# EAGLE schematic Cell stretcher (EAGLE 9.6.2)
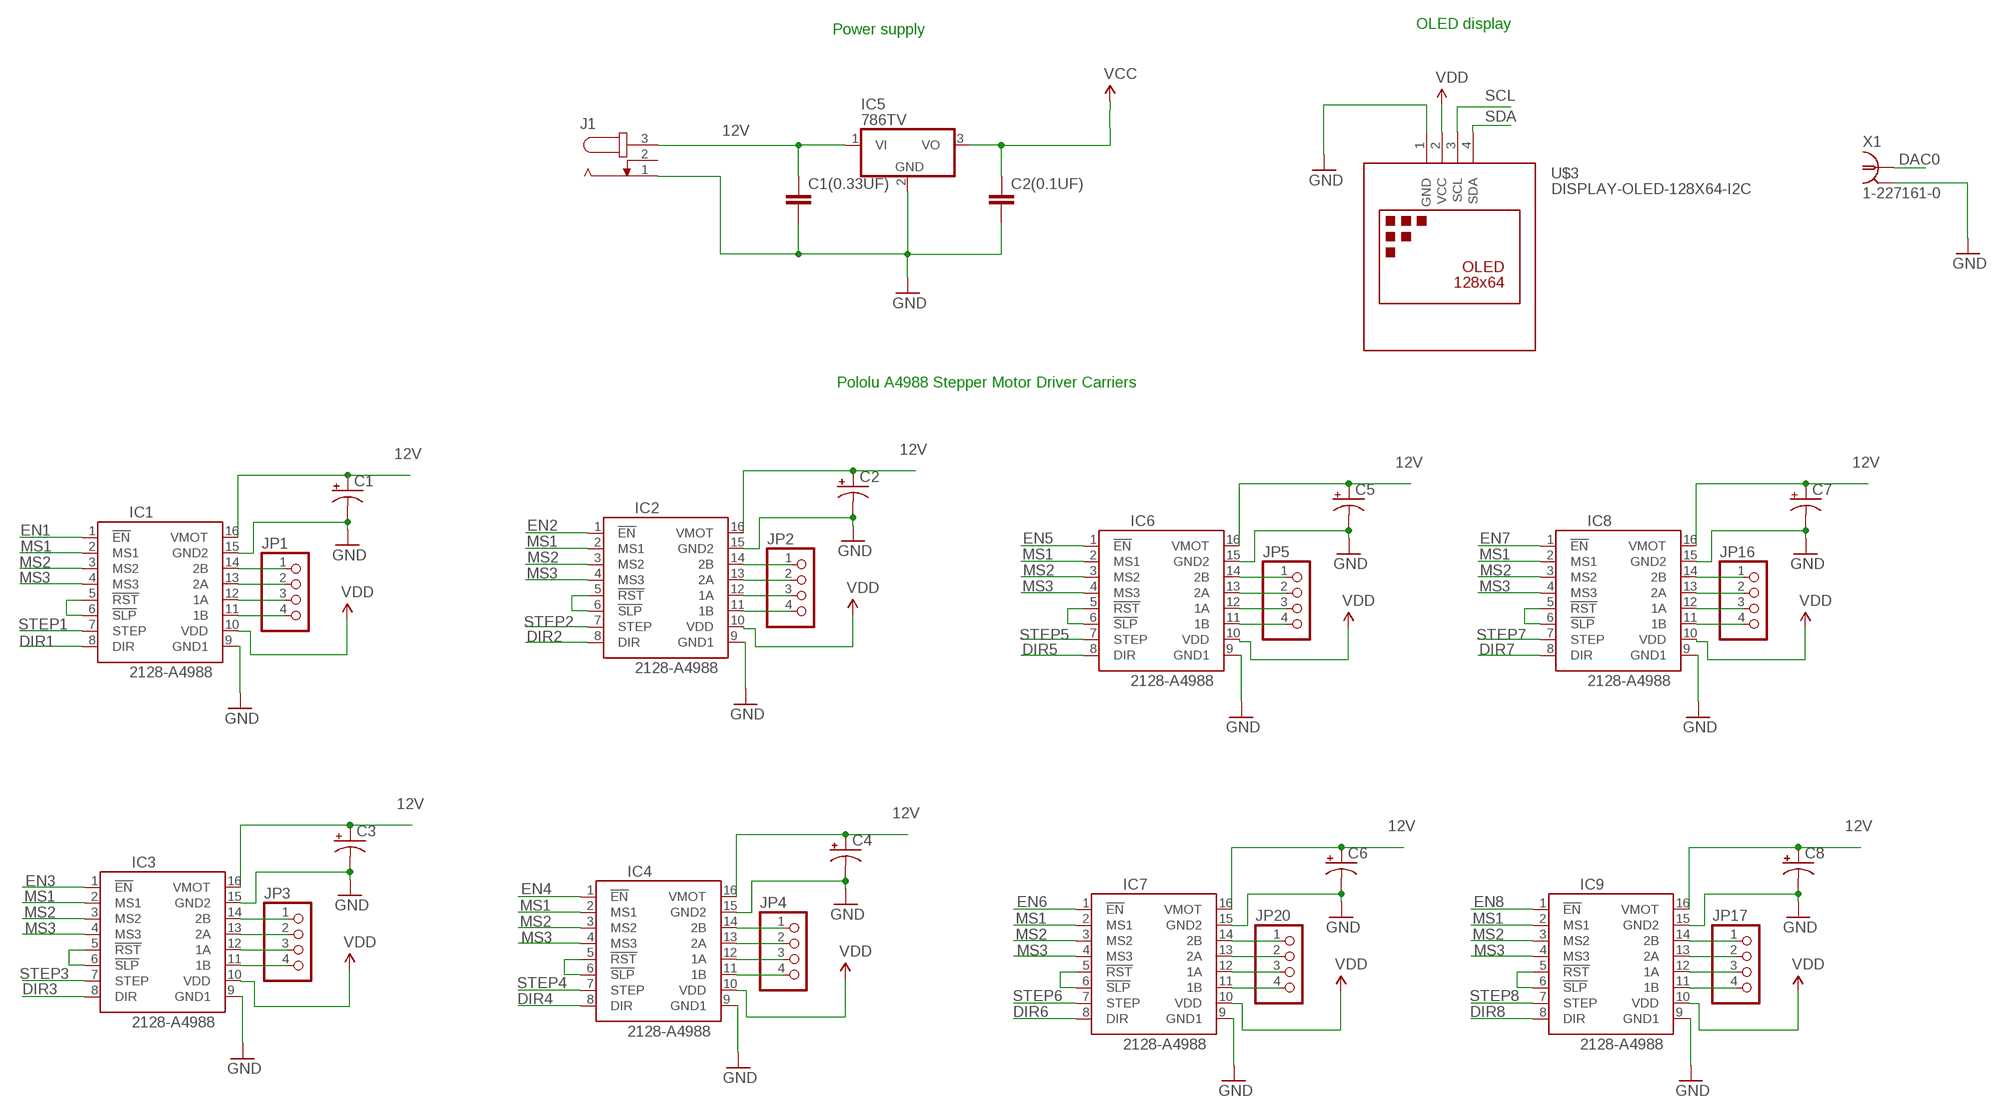
[diagram p0: schematic, sheet 1, part 1 of 2]
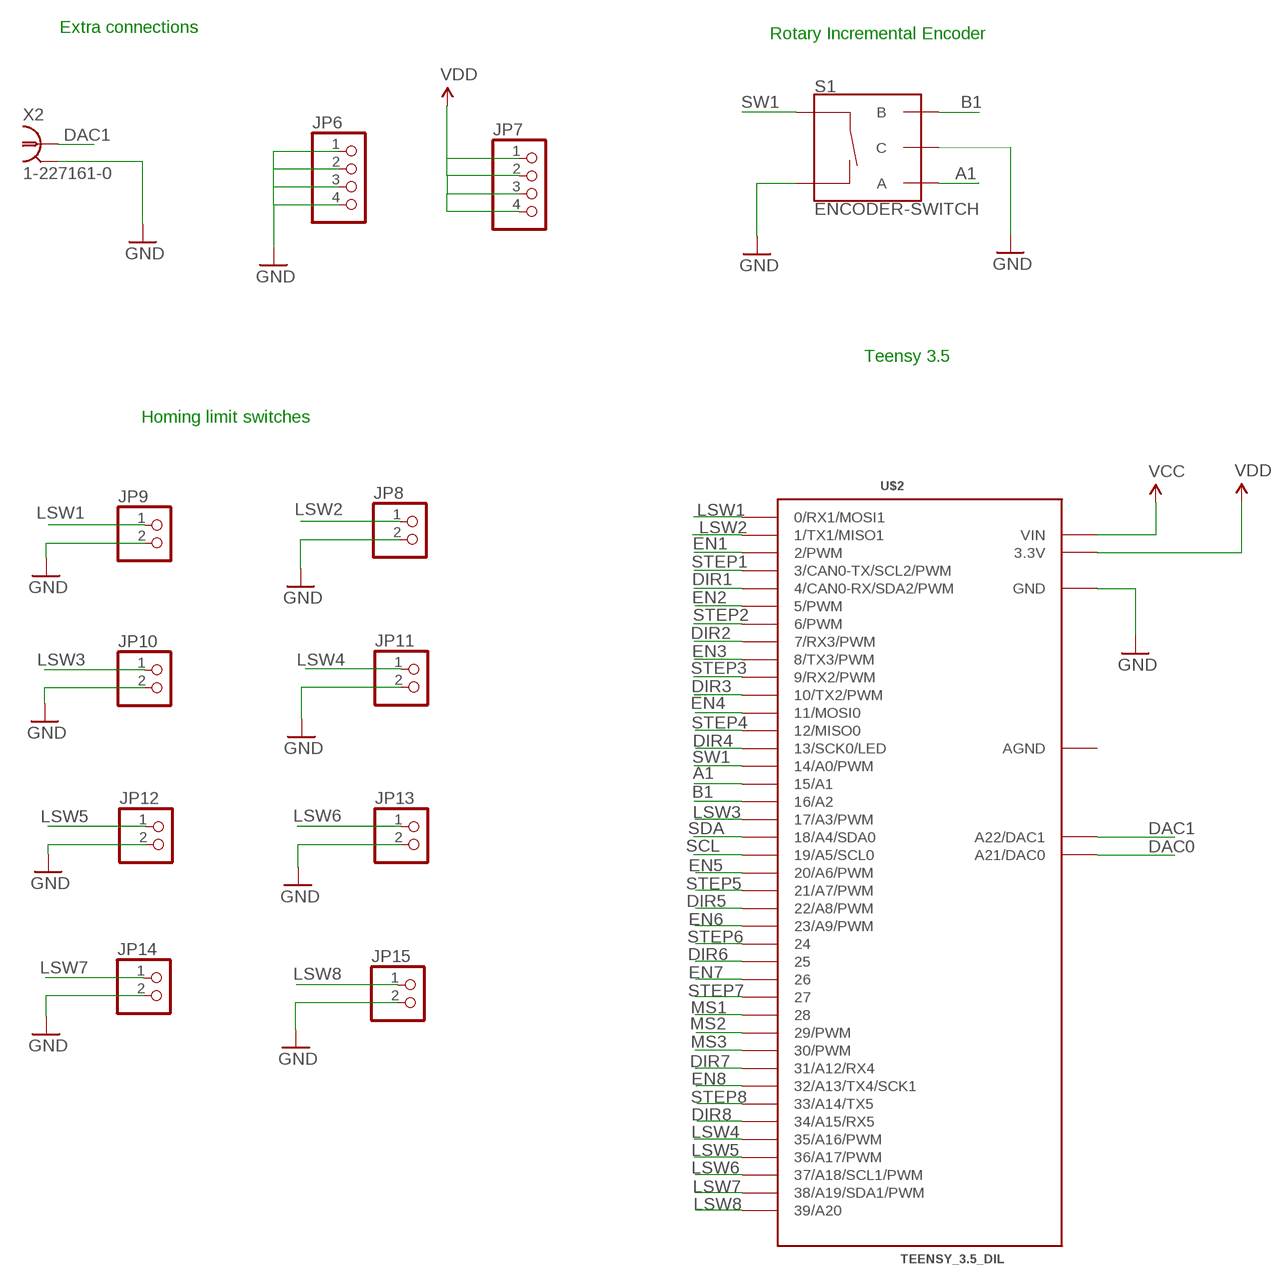
[diagram p1: schematic, sheet 1, part 2 of 2]

## Parts
C1  CPOL-USE5-5  [E5-5]
C1(0.33UF)  C2.5/4  [C2.5-4]
C2  CPOL-USE5-5  [E5-5]
C2(0.1UF)  C2.5/2  [C2.5-2]
C3  CPOL-USE5-5  [E5-5]
C4  CPOL-USE5-5  [E5-5]
C5  CPOL-USE5-5  [E5-5]
C6  CPOL-USE5-5  [E5-5]
C7  CPOL-USE5-5  [E5-5]
C8  CPOL-USE5-5  [E5-5]
IC1  2128-A4988  [A4988]
IC2  2128-A4988  [A4988]
IC3  2128-A4988  [A4988]
IC4  2128-A4988  [A4988]
IC5  786TV  [TO220V]
IC6  2128-A4988  [A4988]
IC7  2128-A4988  [A4988]
IC8  2128-A4988  [A4988]
IC9  2128-A4988  [A4988]
J1  JACK-PLUG0  [SPC4077]
JP1  PINHD-1X4  [1X04]
JP2  PINHD-1X4  [1X04]
JP3  PINHD-1X4  [1X04]
JP4  PINHD-1X4  [1X04]
JP5  PINHD-1X4  [1X04]
JP6  PINHD-1X4  [1X04]
JP7  PINHD-1X4  [1X04]
JP8  PINHD-1X2  [1X02]
JP9  PINHD-1X2  [1X02]
JP10  PINHD-1X2  [1X02]
JP11  PINHD-1X2  [1X02]
JP12  PINHD-1X2  [1X02]
JP13  PINHD-1X2  [1X02]
JP14  PINHD-1X2  [1X02]
JP15  PINHD-1X2  [1X02]
JP16  PINHD-1X4  [1X04]
JP17  PINHD-1X4  [1X04]
JP20  PINHD-1X4  [1X04]
S1  ENCODER-SWITCH  [ROTARY_ENC_PLAIN]
U$2  TEENSY_3.5_DIL  [TEENSY_3.5_DIL]
U$3  DISPLAY-OLED-128X64-I2C  [DISPLAY-OLED-128X64-I2C]
X1  1-227161-0  [AMP_227161]
X2  1-227161-0  [AMP_227161]

## Nets
12V: C1(0.33UF).1 C1.+ C2.+ C3.+ C4.+ C5.+ C6.+ C7.+ C8.+ IC1.16(VMOT) IC2.16(VMOT) IC3.16(VMOT) IC4.16(VMOT) IC5.1(VI) IC6.16(VMOT) IC7.16(VMOT) IC8.16(VMOT) IC9.16(VMOT) J1.3
A1: S1.A U$2.15/A1
B1: S1.B U$2.16/A2
DAC0: U$2.A21(A21/DAC0) X1.1
DAC1: U$2.A22(A22/DAC1) X2.1
DIR1: IC1.8(DIR) U$2.4(4/CAN0-RX/SDA2/PWM)
DIR2: IC2.8(DIR) U$2.7(7/RX3/PWM)
DIR3: IC3.8(DIR) U$2.10(10/TX2/PWM)
DIR4: IC4.8(DIR) U$2.13(13/SCK0/LED)
DIR5: IC6.8(DIR) U$2.22/A8(22/A8/PWM)
DIR6: IC7.8(DIR) U$2.25
DIR7: IC8.8(DIR) U$2.31/A12(31/A12/RX4)
DIR8: IC9.8(DIR) U$2.34/A15(34/A15/RX5)
EN1: IC1.1(!EN) U$2.2(2/PWM)
EN2: IC2.1(!EN) U$2.5(5/PWM)
EN3: IC3.1(!EN) U$2.8(8/TX3/PWM)
EN4: IC4.1(!EN) U$2.11(11/MOSI0)
EN5: IC6.1(!EN) U$2.20/A6(20/A6/PWM)
EN6: IC7.1(!EN) U$2.23/A9(23/A9/PWM)
EN7: IC8.1(!EN) U$2.26
EN8: IC9.1(!EN) U$2.32/A13(32/A13/TX4/SCK1)
GND: C1(0.33UF).2 C1.- C2(0.1UF).2 C2.- C3.- C4.- C5.- C6.- C7.- C8.- IC1.9(GND1) IC1.15(GND2) IC2.9(GND1) IC2.15(GND2) IC3.9(GND1) IC3.15(GND2) IC4.9(GND1) IC4.15(GND2) IC5.2(GND) IC6.9(GND1) IC6.15(GND2) IC7.9(GND1) IC7.15(GND2) IC8.9(GND1) IC8.15(GND2) IC9.9(GND1) IC9.15(GND2) J1.1 JP6.1 JP6.2 JP6.3 JP6.4 JP8.2 JP9.2 JP10.2 JP11.2 JP12.2 JP13.2 JP14.2 JP15.2 S1.C S1.SW- U$2.GND U$2.GND1(GND) U$3.1(GND) X1.2 X2.2
LSW1: JP9.1 U$2.0(0/RX1/MOSI1)
LSW2: JP8.1 U$2.1(1/TX1/MISO1)
LSW3: JP10.1 U$2.17/A3(17/A3/PWM)
LSW4: JP11.1 U$2.35/A16(35/A16/PWM)
LSW5: JP12.1 U$2.36/A17(36/A17/PWM)
LSW6: JP13.1 U$2.37/A18(37/A18/SCL1/PWM)
LSW7: JP14.1 U$2.38/A19(38/A19/SDA1/PWM)
LSW8: JP15.1 U$2.39/A20
MS1: IC1.2(MS1) IC2.2(MS1) IC3.2(MS1) IC4.2(MS1) IC6.2(MS1) IC7.2(MS1) IC8.2(MS1) IC9.2(MS1) U$2.28
MS2: IC1.3(MS2) IC2.3(MS2) IC3.3(MS2) IC4.3(MS2) IC6.3(MS2) IC7.3(MS2) IC8.3(MS2) IC9.3(MS2) U$2.29(29/PWM)
MS3: IC1.4(MS3) IC2.4(MS3) IC3.4(MS3) IC4.4(MS3) IC6.4(MS3) IC7.4(MS3) IC8.4(MS3) IC9.4(MS3) U$2.30(30/PWM)
N$1: IC1.14(2B) JP1.1
N$2: IC1.13(2A) JP1.2
N$3: IC1.12(1A) JP1.3
N$4: IC1.11(1B) JP1.4
N$5: IC2.14(2B) JP2.1
N$6: IC2.13(2A) JP2.2
N$7: IC2.12(1A) JP2.3
N$8: IC2.11(1B) JP2.4
N$9: IC6.14(2B) JP5.1
N$10: IC6.13(2A) JP5.2
N$11: IC6.12(1A) JP5.3
N$12: IC6.11(1B) JP5.4
N$13: IC6.5(!RST) IC6.6(!SLP)
N$14: IC7.14(2B) JP20.1
N$15: IC2.5(!RST) IC2.6(!SLP)
N$16: IC7.13(2A) JP20.2
N$17: IC7.12(1A) JP20.3
N$18: IC7.11(1B) JP20.4
N$19: IC7.5(!RST) IC7.6(!SLP)
N$20: IC8.14(2B) JP16.1
N$21: IC8.13(2A) JP16.2
N$22: IC8.12(1A) JP16.3
N$23: IC1.5(!RST) IC1.6(!SLP)
N$24: IC3.14(2B) JP3.1
N$25: IC3.13(2A) JP3.2
N$26: IC3.12(1A) JP3.3
N$27: IC3.11(1B) JP3.4
N$28: IC8.11(1B) JP16.4
N$29: IC8.5(!RST) IC8.6(!SLP)
N$30: IC9.14(2B) JP17.1
N$31: IC9.13(2A) JP17.2
N$32: IC9.12(1A) JP17.3
N$33: IC9.11(1B) JP17.4
N$34: IC9.5(!RST) IC9.6(!SLP)
N$35: IC3.5(!RST) IC3.6(!SLP)
N$37: IC4.14(2B) JP4.1
N$38: IC4.13(2A) JP4.2
N$39: IC4.12(1A) JP4.3
N$40: IC4.11(1B) JP4.4
N$47: IC4.5(!RST) IC4.6(!SLP)
SCL: U$2.19/A5(19/A5/SCL0) U$3.3(SCL)
SDA: U$2.18/A4(18/A4/SDA0) U$3.4(SDA)
STEP1: IC1.7(STEP) U$2.3(3/CAN0-TX/SCL2/PWM)
STEP2: IC2.7(STEP) U$2.6(6/PWM)
STEP3: IC3.7(STEP) U$2.9(9/RX2/PWM)
STEP4: IC4.7(STEP) U$2.12(12/MISO0)
STEP5: IC6.7(STEP) U$2.21/A7(21/A7/PWM)
STEP6: IC7.7(STEP) U$2.24
STEP7: IC8.7(STEP) U$2.27
STEP8: IC9.7(STEP) U$2.33/A14(33/A14/TX5)
SW1: S1.SW+ U$2.14/A0(14/A0/PWM)
VCC: C2(0.1UF).1 IC5.3(VO) U$2.VIN
VDD: IC1.10(VDD) IC2.10(VDD) IC3.10(VDD) IC4.10(VDD) IC6.10(VDD) IC7.10(VDD) IC8.10(VDD) IC9.10(VDD) JP7.1 JP7.2 JP7.3 JP7.4 U$2.3.3V U$2.3.3V3(3.3V) U$3.2(VCC)
Unconnected: J1.2

## Notes on the sheet
- OLED display
- Power supply
- Extra connections
- Rotary Incremental Encoder
- Teensy 3.5
- Pololu A4988 Stepper Motor Driver Carriers
- Homing limit switches

## Power pins joined to a net without a drawn wire
AGND: U$2.AGND

## Library data of the parts
C1-C8 = adafruit:CPOL-US: POLARIZED CAPACITOR, American symbol
C1(0.33UF) C2(0.1UF) = capacitor-wima:C: CAPACITOR naming: grid - package width
IC1-IC4 IC6-IC9 = pololu-stepper-driver:2128-A4988: A4988 Stepper Motor Driver Carrier; Black Edition #2128 A4988 Stepper Motor Driver Carrier; Black Edition <https://www.pololu.com/product/2128> in Japan, Suzaku Lab. Ltd. <https://suzakugiken.jp/> #2128 A4988ステッピングモータドライバ Black Edition <https://szc.jp/po2128>
IC5 = linear:78*: Positive VOLTAGE REGULATOR Source: http://cache.national.com/ds/LM/LM78L05.pdf http://www.fairchildsemi.com/ds/LM/LM7805.pdf
J1 = con-jack:JACK-PLUG: DC POWER JACK Power Jack, DC, Right Angle, Through Hole, Rated 5A at 16VDC, PC Terminals Distributor: Farnell (www.Farnell.de) Drawing: 84N1161.pdf / 84N1162.pdf Manufacturer: SPC Technology (www.spctechnology.com) Type: SPC4077 / SPC 4078; OC_FARNELL: unknown; OC_NEWARK: unknown
JP1-JP7 JP16 JP17 JP20 = pinhead:PINHD-1X4: PIN HEADER
JP8-JP15 = pinhead:PINHD-1X2: PIN HEADER
S1 = SparkFun-Switches:ENCODER-SWITCH: Rotary Encoder w/ Select Switch Encoders rotate similarly to potentiometers, but they’re different from potentiometers in that an encoder has full rotation without limits. They output gray code so that you can tell how much and in which direction the encoder has been turned. This encoder includes a push-down select switch built into the shaft. SparkFun Products Rotary Encoder <https://www.sparkfun.com/products/9117> (COM-09117); SF_SKU: COM-09117
U$2 = Teensy_3_and_LC_Series_Boards_v1.4:TEENSY_3.5_DIL: DIL version of the Teensy 3.5
U$3 = diy-modules:DISPLAY-OLED-128X64-I2C: 128x64 Dot Matrix OLED Module based on SSD1306 chip Variant with I2C interface More details available here: http://www.instructables.com/id/Monochrome-096-i2c-OLED-display-with-arduino-SSD13/ SSD1306 datasheet: https://cdn-shop.adafruit.com/datasheets/SSD1306.pdf Click here to find device on ebay.com <http://www.ebay.com/sch/oled+display+128x64+iic> Note: There are two variants: I2C and SPI. Search for the proper version.
X1 X2 = con-coax_xavi:?227161*: JACK, RIGHT ANGLE, 50 OHM, PCB, BNC Source: amp_227161.pdf; MF: TYCO ELECTRONICS; MPN: 1-227161; OC_FARNELL: unknown; OC_NEWARK: 33B3200

## Net classes
0 default: width 0.203 mm, drill 0.406 mm, clearance 0.203 mm